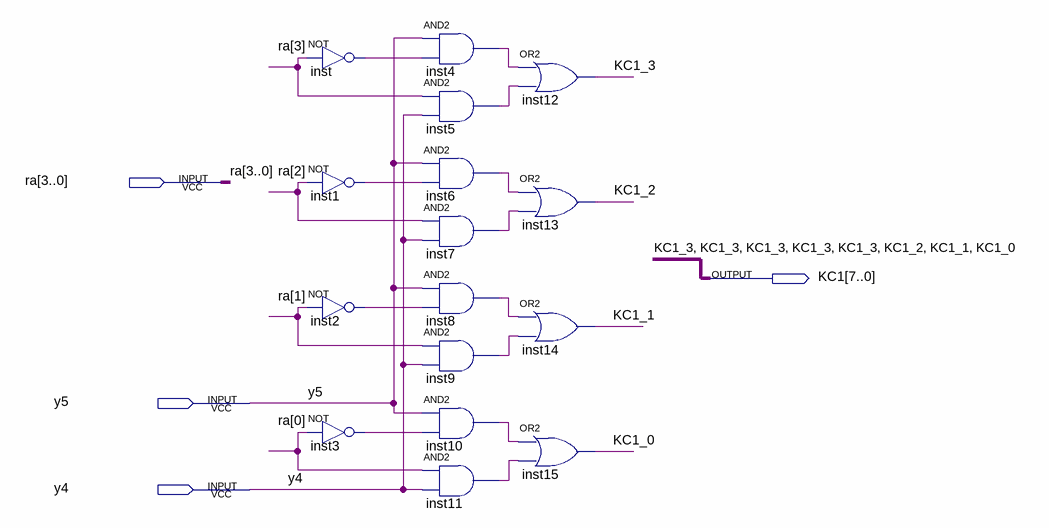
[diagram p0: schematic sheet]
// Quartus schematic KC1.bdf as structural Verilog: 16 symbols, 4 pins
module KC1 (
  input  [3:0] ra,
  input  y5,
  input  y4,
  output [7:0] KC1
);

  wire inst1_out, inst2_out, inst3_out, inst4_out, inst5_out, inst6_out, inst7_out, inst8_out, inst9_out,
       inst10_out, inst11_out, inst_out;

  not inst (inst_out, ra[3]);
  not inst1 (inst1_out, ra[2]);
  not inst2 (inst2_out, ra[1]);
  not inst3 (inst3_out, ra[0]);
  and inst4 (inst4_out, y5, inst_out);
  and inst5 (inst5_out, ra[3], y4);
  and inst6 (inst6_out, y5, inst1_out);
  and inst7 (inst7_out, ra[2], y4);
  and inst8 (inst8_out, y5, inst2_out);
  and inst9 (inst9_out, ra[1], y4);
  and inst10 (inst10_out, y5, inst3_out);
  and inst11 (inst11_out, ra[0], y4);
  or inst12 (KC1[7], inst4_out, inst5_out);
  or inst13 (KC1[2], inst6_out, inst7_out);
  or inst14 (KC1[1], inst8_out, inst9_out);
  or inst15 (KC1[0], inst10_out, inst11_out);

  assign KC1[6:3] = {4{KC1[7]}};

  // Other names for the same wires on the sheet: KC1_0 = KC1[0]; KC1_1 = KC1[1]; KC1_2 = KC1[2]; KC1_3 = KC1[7]
endmodule
